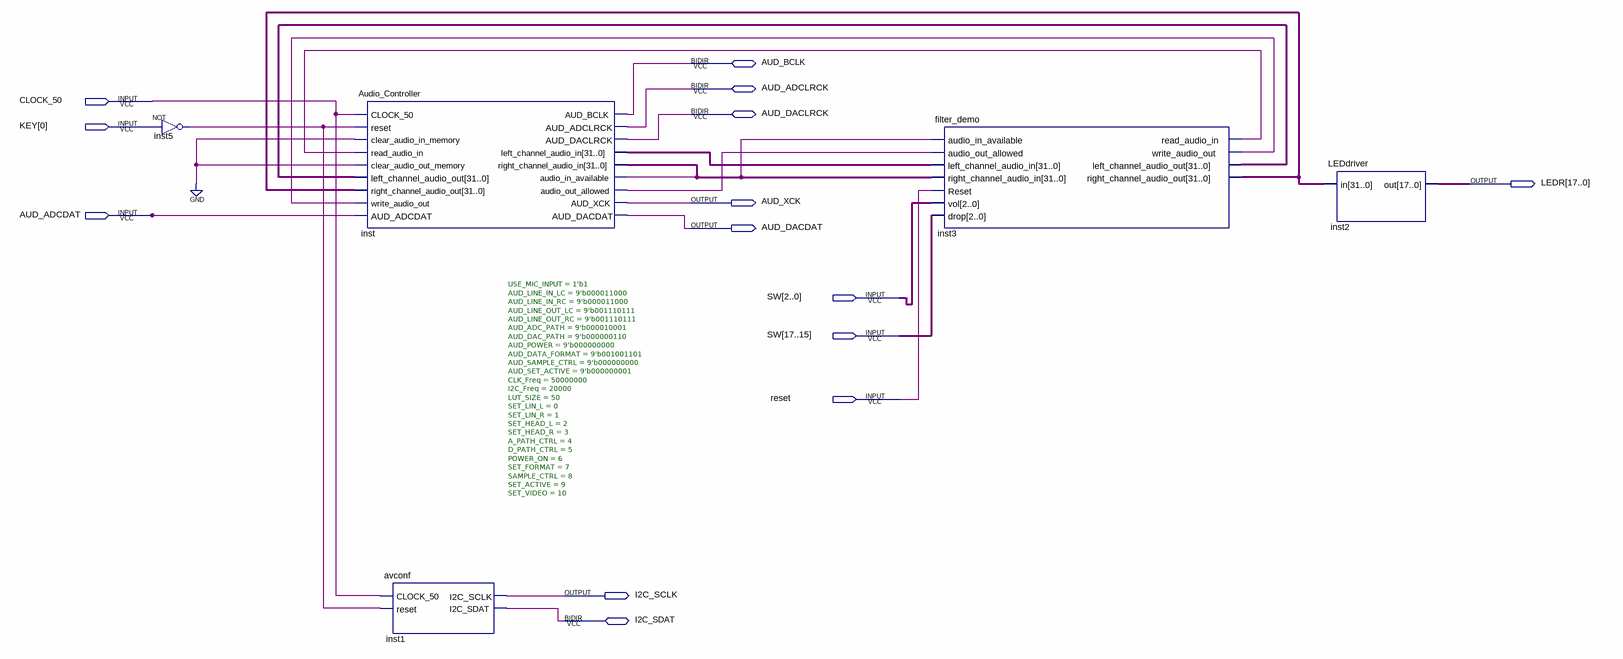
[diagram p0: schematic sheet]
// Quartus schematic toplevel.bdf as structural Verilog: 5 symbols, 14 pins
module toplevel (
  input  CLOCK_50,
  input  [0:0] KEY,
  input  AUD_ADCDAT,
  input  [17:0] SW,
  input  reset,
  inout  AUD_BCLK,
  inout  AUD_ADCLRCK,
  inout  AUD_DACLRCK,
  inout  I2C_SDAT,
  output [17:0] LEDR,
  output AUD_XCK,
  output AUD_DACDAT,
  output I2C_SCLK
);

  wire inst3_read_audio_in, inst3_write_audio_out, inst5_out, inst_audio_in_available,
       inst_audio_out_allowed, undriven;
  wire [31:0] inst3_left_channel_audio_out, inst3_right_channel_audio_out, inst_left_channel_audio_in,
       inst_right_channel_audio_in;

  not inst5 (inst5_out, KEY[0]);
  Audio_Controller inst (
    .CLOCK_50(CLOCK_50), .reset(inst5_out), .clear_audio_in_memory(1'b0),
    .read_audio_in(inst3_read_audio_in), .clear_audio_out_memory(1'b0),
    .left_channel_audio_out(inst3_left_channel_audio_out),
    .right_channel_audio_out(inst3_right_channel_audio_out), .write_audio_out(inst3_write_audio_out),
    .AUD_ADCDAT(AUD_ADCDAT), .left_channel_audio_in(inst_left_channel_audio_in),
    .right_channel_audio_in(inst_right_channel_audio_in), .audio_in_available(inst_audio_in_available),
    .audio_out_allowed(inst_audio_out_allowed), .AUD_XCK(AUD_XCK), .AUD_DACDAT(AUD_DACDAT),
    .AUD_BCLK(AUD_BCLK), .AUD_ADCLRCK(AUD_ADCLRCK), .AUD_DACLRCK(AUD_DACLRCK));
  avconf #(.USE_MIC_INPUT(1'b1), .AUD_LINE_IN_LC(9'b000011000), .AUD_LINE_IN_RC(9'b000011000), .AUD_LINE_OUT_LC(9'b001110111), .AUD_LINE_OUT_RC(9'b001110111), .AUD_ADC_PATH(9'b000010001), .AUD_DAC_PATH(9'b000000110), .AUD_POWER(9'b000000000), .AUD_DATA_FORMAT(9'b001001101), .AUD_SAMPLE_CTRL(9'b000000000), .AUD_SET_ACTIVE(9'b000000001), .CLK_Freq(50000000), .I2C_Freq(20000), .LUT_SIZE(50), .SET_LIN_L(0), .SET_LIN_R(1), .SET_HEAD_L(2), .SET_HEAD_R(3), .A_PATH_CTRL(4), .D_PATH_CTRL(5), .POWER_ON(6), .SET_FORMAT(7), .SAMPLE_CTRL(8), .SET_ACTIVE(9), .SET_VIDEO(10)) inst1 (
    .CLOCK_50(CLOCK_50), .reset(inst5_out), .I2C_SCLK(I2C_SCLK), .I2C_SDAT(I2C_SDAT));
  filter_demo inst3 (
    .audio_in_available(undriven), .audio_out_allowed(inst_audio_out_allowed),
    .left_channel_audio_in(inst_left_channel_audio_in), .right_channel_audio_in(inst_right_channel_audio_in),
    .Reset(reset), .vol(SW[2:0]), .drop(SW[17:15]), .read_audio_in(inst3_read_audio_in),
    .write_audio_out(inst3_write_audio_out), .left_channel_audio_out(inst3_left_channel_audio_out),
    .right_channel_audio_out(inst3_right_channel_audio_out));
  LEDdriver inst2 (.in(inst3_right_channel_audio_out), .out(LEDR));
endmodule
